# Altium schematic sheet compute module USB.SchDoc: Compute Module USB
size A4; Organization: Blinkinlabs, LLC; DocumentNumber: 7; SheetNumber: 7; SheetTotal: 14
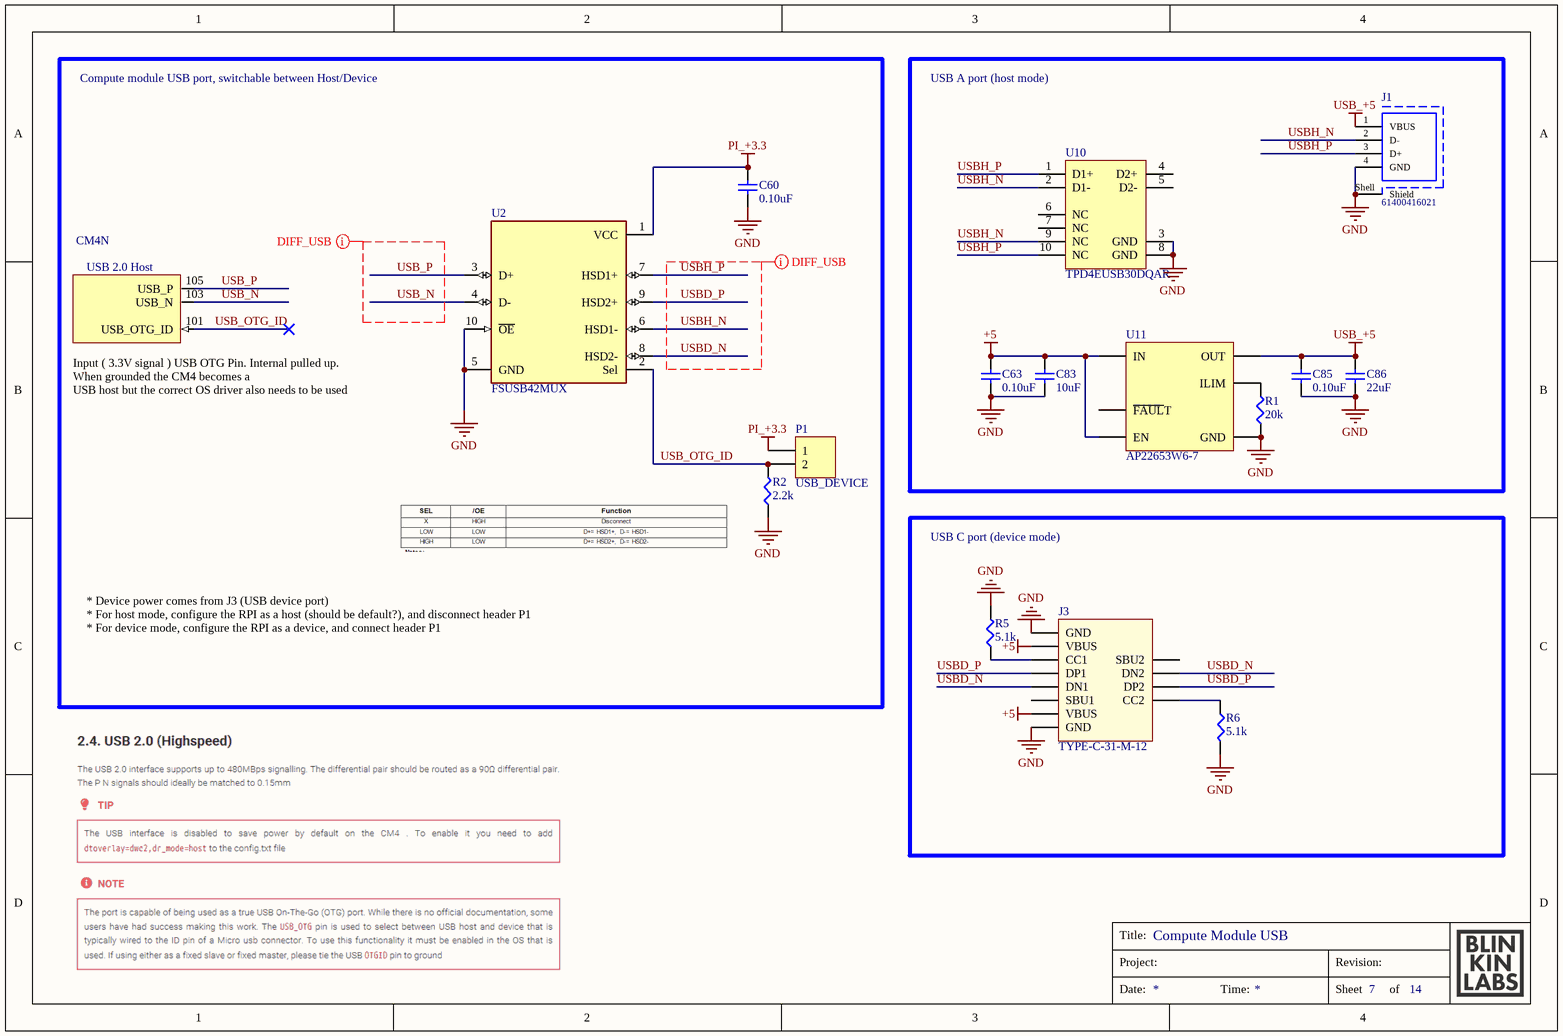
[diagram p0: compute module USB.SchDoc]

## Parts
C60  0.10uF  [CAPC1005X06L]
C63  0.10uF  [CAPC1005X06L]
C83  10uF  [CAPC2012X10L]
C85  0.10uF  [CAPC1005X06L]
C86  22uF  [CAPC2012X10L]
CM4  Raspberry Pi Compute Module 4  [CM4-F40C-100DS-0.4v_1.5mm_0mm]  (value not drawn)  (part N of 21)
J1  61400416021  [61400416021]
J3  TYPE-C-31-M-12  [TYPE-C-31-M-12]
P1  USB_DEVICE  [HDR1X2]
R1  20k  [ERJ2G(0402)_L]
R2  2.2k  [ERJ2G(0402)_L]
R5  5.1k  [ERJ2G(0402)_N]
R6  5.1k  [ERJ2G(0402)_N]
U2  FSUSB42MUX  [FP-846AP-MFG]
U10  TPD4EUSB30DQAR  [DQA0010A_V]
U11  AP22653W6-7  [SOT95P280X145-6N-5]

## Blocks framed on the sheet
Compute module USB port, switchable between Host/Device: C60 CM4 P1 R2 U2
USB A port (host mode): C63 C83 C85 C86 J1 R1 U10 U11
USB C port (device mode): J3 R5 R6

## Nets
+5: C63.2 C83.1 J3.A4/B9(VBUS) J3.A9/B4(VBUS) U11.1(IN) U11.3(EN)
GND: C60.1 C63.1 C83.2 C85.1 C86.2 J1.4(GND) J1.Shell(Shield) J3.A1/B12(GND) J3.A12/B1(GND) R1.1 R2.1 R5.2 R6.2 U2.5(GND) U2.10(~{OE}) U10.3(GND) U10.8(GND) U11.2(GND)
PI_+3.3: C60.2 P1.1 U2.1(VCC)
USB_+5: C85.2 C86.1 J1.1(VBUS) U11.6(OUT)
USB_N: CM4.103(USB_N) U2.4(D-)
USB_OTG_ID: CM4.101(USB_OTG_ID) P1.2 R2.2 U2.2(Sel)
USB_P: CM4.105(USB_P) U2.3(D+)
USBD_N: J3.A7(DN1) J3.B7(DN2) U2.8(HSD2-)
USBD_P: J3.A6(DP1) J3.B6(DP2) U2.9(HSD2+)
USBH_N: J1.2(D-) U2.6(HSD1-) U10.2(D1-) U10.9(NC)
USBH_P: J1.3(D+) U2.7(HSD1+) U10.1(D1+) U10.10(NC)
NetJ3_A5: J3.A5(CC1) R5.1
NetJ3_B5: J3.B5(CC2) R6.1
NetR1_2: R1.2 U11.5(ILIM)

Not connected (* = marked no-connect by the designer): J3 A8(SBU1) B8(SBU2); U10 4(D2+) 5(D2-) 6(NC) 7(NC); U11 4(~{FAUL}T)

## Layout directives
differential pair; differential pair class DIFF_90Ohm_USB; differential pair class DIFF_USB_HS; net class USB_480MBps; rule Matched Net Lengths [Tolerance = 0.15mm]: USB_N, USB_P, USBD_N, USBD_P, USBH_N, USBH_P

## Notes on the sheet
- * Device power comes from J3 (USB device port)
  * For host mode, configure the RPI as a host (should be default?), and disconnect header P1
  * For device mode, configure the RPI as a device, and connect header P1
- Title:
- Project:
- Revision:
- Date:
- Time:
- Sheet
- of
- (in symbol CM4, part N) USB 2.0 Host; Input ( 3.3V signal ) USB OTG Pin. Internal pulled up. When grounded the CM4 becomes a / USB host but the correct OS driver also needs to be used

## Library data of the parts
C60 C63 C85 = GRM155R61A104KA01D: CAP CER 0.1UF 10V X5R 0402; Manufacturer: Murata Electronics North America; Tolerance: ±10%; PartNumber: GRM155R61A104KA01D; Datasheets: http://www.murata.com/~/media/webrenewal/support/library/catalog/products/capacitor/mlcc/c02e.pdf; Image: //media.digikey.com/Renders/Murata%20Renders/ZRB-SERIES-0402.jpg; Digi-Key Part Number: 490-1318-1-ND; Packaging: Cut Tape (CT); Series: GRM; Value: 0.10uF; Voltage: 10V; Temperature Coefficient: X5R; Operating Temperature: -55°C ~ 85°C; Features: -; Applications: General Purpose; Package / Case: 0402 (1005 Metric); Case/Package: 0402
C83 = GRM21BR71A106KE51L: CAP CER 10UF 10V X7R 0805; Manufacturer: Murata Electronics North America; Tolerance: ±10%; PartNumber: GRM21BR71A106KE51L; Datasheets: http://www.murata.com/~/media/webrenewal/support/library/catalog/products/capacitor/mlcc/c02e.pdf; Image: //media.digikey.com/Renders/Murata%20Renders/0805%20(2012%20Metric)%20.85mm.jpg; Digi-Key Part Number: 490-3905-1-ND; Series: GRM; Part Status: Active; Value: 10uF; Voltage: 10V; Temperature Coefficient: X7R; Operating Temperature: -55°C ~ 125°C; Features: -; Applications: General Purpose; Mounting Type: Surface Mount, MLCC; Package / Case: 0805 (2012 Metric); Case/Package: 0805
C86 = GRM219R61A226MEA0D: CAP CER 22UF 10V X5R 0805; Manufacturer: Murata Electronics North America; Tolerance: ±20%; PartNumber: GRM219R61A226MEA0D; Datasheets: http://www.murata.com/~/media/webrenewal/support/library/catalog/products/capacitor/mlcc/c02e.pdf; Image: //media.digikey.com/Renders/Murata%20Renders/0805%20(2012%20Metric)%20.85mm.jpg; Digi-Key Part Number: 490-9951-1-ND; Series: GRM; Part Status: Active; Value: 22uF; Voltage: 10V; Temperature Coefficient: X5R; Operating Temperature: -55°C ~ 85°C; Features: Derating Recommended; Applications: General Purpose; Mounting Type: Surface Mount, MLCC; Package / Case: 0805 (2012 Metric); Case/Package: 0805
CM4 = CM4: Raspberry Pi Compute Module 4 by Amornthep Phunsin
J1 = CMP-1502-03227-1: USB 2.0 Type A Receptacle WR-COM, Horizontal, THT; Manufacturer: Wurth Elektronik; Working Voltage: 30VAC; Rated Current: 1.5A; Contact Resistance: 20mOhm; Manufacturer URL: http://www.we-online.de; Publisher: WurthElektronik; Packaging: Tray; Operating Temperature: -40to105degC; Orientation: Horizontal; Mounting Technology: THT; Part Number: 61400416021; Gender: Receptacle; Package Reference: 61400416021; Connector Type: USB2.0TypeA; Datasheet URL: https://katalog.we-online.de/em/datasheet/61400416021.pdf
J3 = TYPE-C-31-M-12: USB Connector TYPE-C-31-M-12 Female 16P SMD; Manufacturer: HRO; PartNumber: TYPE-C-31-M-12
P1 = Header 2: Header, 2-Pin; LatestRevisionDate: 17-Jul-2002; LatestRevisionNote: Re-released for DXP Platform.; Publisher: Altium Limited
R1 = ERJ-2RKF2002X: RES SMD 20K OHM 1% 1/10W 0402; Manufacturer: Panasonic Electronic Components; Power (Watts): 0.1W, 1/10W; Temperature Coefficient: ±100ppm/°C; PartNumber: ERJ-2RKF2002X; Datasheets: http://industrial.panasonic.com/www-cgi/jvcr13pz.cgi?E+PZ+3+AOA0002+ERJ2RKF2002X+7+WW; Image: //media.digikey.com/Photos/Panasonic%20Photos/ERJ-PA2-Series.jpg; Digi-Key Part Number: P20.0KLCT-ND; Series: ERJ; Value: 20k; Tolerance: ±1%; Composition: Thick Film; Features: Automotive AEC-Q200; Operating Temperature: -55°C ~ 155°C; Package / Case: 0402 (1005 Metric); Case/Package: 0402; Size / Dimension: 0.039" L x 0.020" W (1.00mm x 0.50mm); Height - Seated (Max): 0.016" (0.40mm); Number of Terminations: 2
R2 = ERJ-2RKF2201X: RES SMD 2.2K OHM 1% 1/10W 0402; Manufacturer: Panasonic Electronic Components; Power (Watts): 0.1W, 1/10W; Temperature Coefficient: ±100ppm/°C; PartNumber: ERJ-2RKF2201X; Datasheets: http://industrial.panasonic.com/www-cgi/jvcr13pz.cgi?E+PZ+3+AOA0002+ERJ2RKF2201X+7+WW; Image: //media.digikey.com/Photos/Panasonic%20Photos/ERJ-PA2-Series.jpg; Digi-Key Part Number: P2.20KLCT-ND; Series: ERJ; Value: 2.2k; Tolerance: ±1%; Composition: Thick Film; Features: Automotive AEC-Q200; Operating Temperature: -55°C ~ 155°C; Package / Case: 0402 (1005 Metric); Case/Package: 0402; Size / Dimension: 0.039" L x 0.020" W (1.00mm x 0.50mm); Height - Seated (Max): 0.016" (0.40mm); Number of Terminations: 2
R5 R6 = ERJ-2RKF5101X: RES SMD 5.1K OHM 1% 1/10W 0402; Manufacturer: Panasonic Electronic Components; Power (Watts): 0.1W, 1/10W; Temperature Coefficient: ±100ppm/°C; PartNumber: ERJ-2RKF5101X; Datasheets: http://industrial.panasonic.com/www-cgi/jvcr13pz.cgi?E+PZ+3+AOA0002+ERJ2RKF5101X+7+WW; Image: //media.digikey.com/Photos/Panasonic%20Photos/ERJ-PA2-Series.jpg; Digi-Key Part Number: P5.10KLCT-ND; Series: ERJ; Value: 5.1k; Tolerance: ±1%; Composition: Thick Film; Features: Automotive AEC-Q200; Operating Temperature: -55°C ~ 155°C; Package / Case: 0402 (1005 Metric); Case/Package: 0402; Size / Dimension: 0.039" L x 0.020" W (1.00mm x 0.50mm); Height - Seated (Max): 0.016" (0.40mm); Number of Terminations: 2
U2 = CMP-07103-000004-1: IC USB SWITCH DPDT 10MSOP; Voltage: 4.3V; Current: 100mA; Number of Inputs: 2; Supply Type: Single; Number of Outputs: 4; Data Rate: 480Mbps; On-State Resistance: 6.5R; Min Supply Voltage: 3V; Package Quantity: 1; Length: 3mm; Radiation Hardening: No; Number of Pins: 10; Width: 3mm; Number of Channels: 2; REACH SVHC: No SVHC; Lead Free: Lead Free; Max Operating Temperature: 85°C; Min Operating Temperature: -40°C; Packaging: Tape and Reel; Throw Configuration: DPDT; Operating Supply Voltage: 4.3V; Max Supply Voltage: 4.3V; Mount: Surface Mount; Case/Package: MSOP; Weight: 0.1125g; Height: 0.85mm
U10 = CMP-0326-00027-3: ESD Solution for Super-Speed (6 GBPS) USB 3.0 Interface, 4 Channels, -40 to +85 degC, 10-pin SON (DQA), Green (RoHS & no Sb/Br); Manufacturer: Texas Instruments; Differential Capacitance(pF): 0.05; Serial ATA / eSATA: TRUE; IO Capacitance(Typ)(pF): 0.8; IO Leakage Current(nA): 10; IEC 61000-4-2 Air-Gap(+/- kV): 8; ComponentLink3Description: URL Link1; PartNumber: TPD4EUSB30DQAR; DatasheetVersion: SLVSAC2C; ComponentLink2URL: http://www.ti.com/general/docs/lit/getliterature.tsp?genericPartNumber=TPD4EUSB30&fileType=pdf; USB Super Speed: TRUE; Eco-Plan: Green (RoHS & no Sb/Br); Mounting Technology: Surface Mount; 1394 / Firewire: TRUE; PackageVersion: revB, Sep-2009; SubFamily: ESD Solution; USB Full Speed: TRUE; USB High Speed: TRUE; ComponentLink2Description: Datasheet; ComponentLink1URL: http://www.ti.com/; IEC 61000-4-2 Contact(+/- kV): 8; Breakdown Voltage(Min)(V): 8; PackageReference: DQA0010A; ComponentLink1Description: Manufacturer URL; PackageDescription: 10-Pin Plastic Small Outline No-Lead, 1 x 2.5 x 0.55 mm Body, 0.5 mm Pitch; ComponentLink3URL: SamplesURL:http://www.ti.com/product/tpd4eusb30#samples; HDMI: TRUE
U11 = AP22653W6-7: LOAD SWITCH,SOT26,T&R,3K; Manufacturer: Diodes Incorporated; PartNumber: AP22653W6-7; Digikey PartNumber: 31-AP22653W6-7TR-ND